# Altium schematic sheet Sunsat Full Schematic.SchDoc
size A4; SheetNumber: 3; SheetTotal: 4
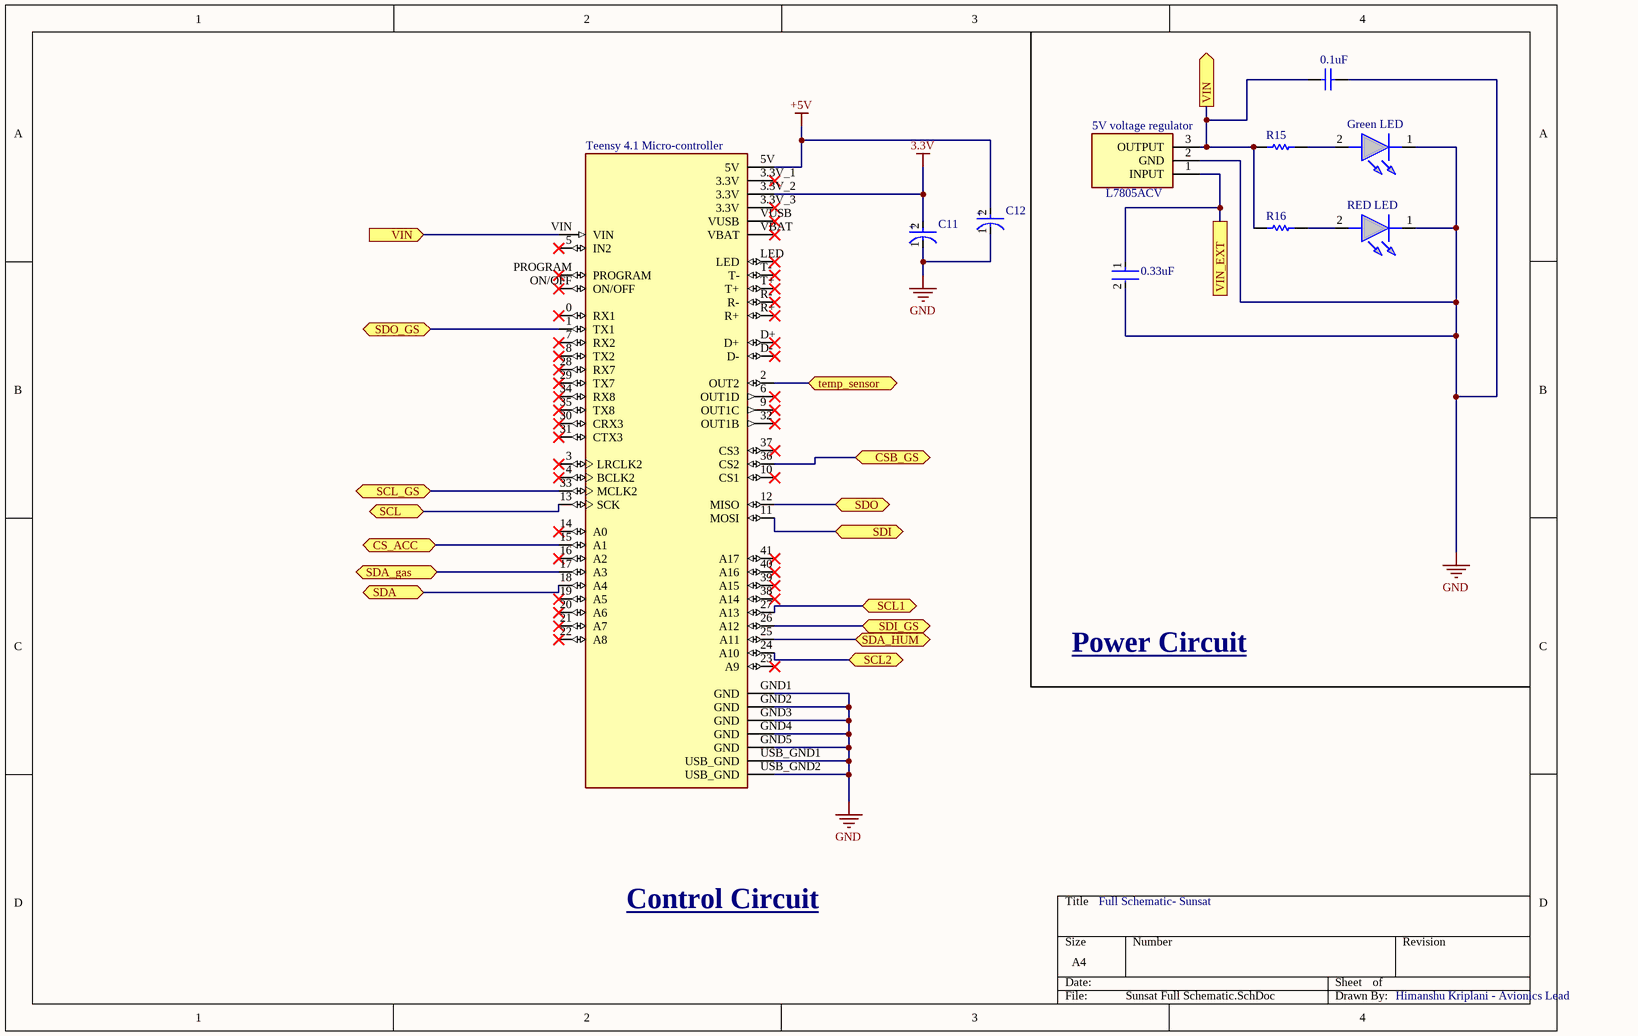
[diagram p0: Sunsat Full Schematic.SchDoc]

## Parts
0.1uF  GRM188R71H104KA93D  [CAPC1608X90X35ML10T15]  (value not drawn)
0.33uF  C2012X8R1E334K125AA  [FP-C2012-125-0_2-IPC_B]  (value not drawn)
5V_voltage_regulator  L7805ACV  [TO255P460X1020X2008-3P]
C11  293D105X0016A2TE3  [FP-293DA-MFG]  (value not drawn)
C12  293D105X0016A2TE3  [FP-293DA-MFG]  (value not drawn)
Green_LED  ASCKCG00-NW5X5020302  [ASCKCG00NW5X5020302]  (value not drawn)
R15  CRCW0603110RFKEA  [RESC1609X50X30NL10T20]  (value not drawn)
R16  CRCW0603110RFKEA  [RESC1609X50X30NL10T20]  (value not drawn)
RED_LED  ASCKCR00-BU5V5020402  [ASCKCR00BU5V5020402]  (value not drawn)
Teensy_4.1_Micro-controller  Teensy 4.1  [MODULE_DEV-16771]  (value not drawn)

## Ports
CS_ACC (bidir, see Sensors schematic[1D]), CSB_GS (bidir, see Gyro Sensor[2C]), SCL1 (bidir, see Sensors schematic[1B]), SCL2 (bidir, see Sensors schematic[2C]), SCL (bidir, see Sensors schematic[2B], Sensors schematic[4A]), SCL_GS (bidir, see Gyro Sensor[2B]), SDA (bidir, see Sensors schematic[2B]), SDA_gas (bidir, see Sensors schematic[3A]), SDA_HUM (bidir, see Sensors schematic[2C]), SDI (bidir, see Sensors schematic[2C]), SDI_GS (bidir, see Gyro Sensor[2B]), SDO (bidir, see Sensors schematic[2C]), SDO_GS (bidir, see Gyro Sensor[2B]), temp_sensor (bidir, see Sensors schematic[1A]), VIN (in, see Sunsat Full Schematic[4A]), VIN (out, see Sunsat Full Schematic[1A]), VIN_EXT (see Sunsat Full Schematic[4B])

## Nets
3.3V: C11.2(A) Teensy_4.1_Micro-controller.3.3V_2(3.3V)
+5V: C12.2(A) Teensy_4.1_Micro-controller.5V
GND: 0.1uF.2 0.33uF.2 5V_voltage_regulator.2(GND) C11.1(C) C12.1(C) Green_LED.1(K) RED_LED.1(K) Teensy_4.1_Micro-controller.GND1(GND) Teensy_4.1_Micro-controller.GND2(GND) Teensy_4.1_Micro-controller.GND3(GND) Teensy_4.1_Micro-controller.GND4(GND) Teensy_4.1_Micro-controller.GND5(GND) Teensy_4.1_Micro-controller.USB_GND1(USB_GND) Teensy_4.1_Micro-controller.USB_GND2(USB_GND)
CS_ACC: Teensy_4.1_Micro-controller.15(A1) ; port CS_ACC
CSB_GS: Teensy_4.1_Micro-controller.36(CS2) ; port CSB_GS
SCL: Teensy_4.1_Micro-controller.13(SCK) ; port SCL
SCL1: Teensy_4.1_Micro-controller.27(A13) ; port SCL1
SCL2: Teensy_4.1_Micro-controller.24(A10) ; port SCL2
SCL_GS: Teensy_4.1_Micro-controller.33(MCLK2) ; port SCL_GS
SDA: Teensy_4.1_Micro-controller.18(A4) ; port SDA
SDA_gas: Teensy_4.1_Micro-controller.17(A3) ; port SDA_gas
SDA_HUM: Teensy_4.1_Micro-controller.25(A11) ; port SDA_HUM
SDI: Teensy_4.1_Micro-controller.11(MOSI) ; port SDI
SDI_GS: Teensy_4.1_Micro-controller.26(A12) ; port SDI_GS
SDO: Teensy_4.1_Micro-controller.12(MISO) ; port SDO
SDO_GS: Teensy_4.1_Micro-controller.1(TX1) ; port SDO_GS
temp_sensor: Teensy_4.1_Micro-controller.2(OUT2) ; port temp_sensor
VIN: 0.1uF.1 5V_voltage_regulator.3(OUTPUT) R15.1 R16.1 Teensy_4.1_Micro-controller.VIN ; port VIN
VIN_EXT: 0.33uF.1 5V_voltage_regulator.1(INPUT) ; port VIN_EXT
NetGreen_LED_2: Green_LED.2(A) R15.2
NetR16_2: R16.2 RED_LED.2(A)

Not connected (* = marked no-connect by the designer): Teensy_4.1_Micro-controller 0(RX1)* 3(LRCLK2)* 3.3V_1(3.3V)* 3.3V_3(3.3V)* 4(BCLK2)* 5(IN2)* 6(OUT1D)* 7(RX2)* 8(TX2)* 9(OUT1C)* 10(CS1)* 14(A0)* 16(A2)* 19(A5)* 20(A6)* 21(A7)* 22(A8)* 23(A9)* 28(RX7)* 29(TX7)* 30(CRX3)* 31(CTX3)* 32(OUT1B)* 34(RX8)* 35(TX8)* 37(CS3)* 38(A14)* 39(A15)* 40(A16)* 41(A17)* D+* D-* LED* ON/OFF* PROGRAM* R+* R-* T+* T-* VBAT* VUSB*

## Notes on the sheet
- Power Circuit
- Control Circuit
- Full Schematic- Sunsat
- Himanshu Kriplani - Avionics Lead
- (in symbol CMP-00030-40940187-1) +

## Library data of the parts
0.1uF = CMP-2100-03643-1: Chip Capacitor, 0.1 uF, +/- 10%, 50 V, -55 to 125 degC, 0603 (1608 Metric), RoHS, Tape and Reel; Manufacturer: Murata; Dielectric Material: Ceramic; Voltage Rating: 50V; Capacitance: 100nF; Dielectric: X7R; Insulation Resistance: 10GR; Case Code (Metric): 1608; Lead Free: LeadFree; Depth: 0.8mm; Number of Pins: 2; Radiation Hardening: No; Case/Package: 0603; Manufacturer URL: http://www.murata.com/; Packaging: TapeandReel; Length: 1.6mm; Contact Plating: Tin; Datasheet URL: http://psearch.en.murata.com/capacitor/product/GRM188R71H104KA93%23.pdf; Tolerance: 10%; Case Code (Imperial): 0603; Min Operating Temperature: -55degC; RoHSCompliant: true; Voltage: 50V; Termination: SMD/SMT; Mount: SurfaceMount; Material: Ceramic; Package Quantity: 1; Height: 0.8mm; Thickness: 0.035inch; REACH SVHC: NoSVHC; Max Operating Temperature: 125degC; Width: 0.8mm; Package Reference: 0603; Voltage Rating (DC): 50V; Datasheet Version: 42675.0; Package Description: 2-Pin Surface Mount Device, Body 1.6 x 0.8 mm
0.33uF = CMP-08246-004363-1: Multilayer Ceramic Capacitors 330nF ±10% 25V X8R SMD 0805; Mount: Surface Mount; Termination: SMD/SMT; Max Operating Temperature: 150°C; Voltage Rating (DC): 25V; Voltage Rating: 25V; Min Operating Temperature: -55°C; Case/Package: 0805; Packaging: Tape and Reel; Width: 0.049inch; Dielectric: X8R; Depth: 1.25mm; Case Code (Imperial): 0805; Capacitance: 330nF; Thickness: 0.057inch; RoHS Compliant: Yes; Features: High Temperature; Resistor Type: Ceramic; Series: C; Height: 1.25mm; Number of Pins: 2; Package Quantity: 1; REACH SVHC: No SVHC; Length: 2mm; Weight: 0.000194oz; Tolerance: 10%; Case Code (Metric): 2012
5V_voltage_regulator = CMP-028-000000-1: Linear voltage regulator,L7805ACV 5V 1A STMicroelectronics L7805ACV, Single Linear Voltage Regulator, 1A 5 V, 2%, 3-Pin TO-220; Geometry.Height: 4.6mm; Manufacturer_Name: STMicroelectronics; Mouser Part Number: 511-L7805ACV; Mouser Price/Stock: https://www.mouser.co.uk/ProductDetail/STMicroelectronics/L7805ACV?qs=xv3lWMc77RdYd2PeLwOwYw%3D%3D; Manufacturer_Part_Number: L7805ACV; Design Item ID: L7805ACV; Datasheet Link: http://www.st.com/web/en/resource/technical/document/datasheet/CD00000444.pdf; Source: L7805ACV.SchLib
C11 C12 = CMP-00030-40940187-1: 293D105X0016A2TE3 Surface Mount Tantalum Capacitor, 1 uF, 16 V, ± 20%, -55 °C, 125 °C, 1206 [3216-18 Metric]; Ripple Current: 90mA; Capacitance: 1µF; Leakage Current: 500nA; Polarity: Polar; Voltage Rating (DC): 16V; Dissipation Factor: 4%; ESR (Equivalent Series Resistance): 9.3Ω; Case Code (Imperial): 1206; Case/Package: 1206; Schedule B: 8532210050, 8532210050; Height: 1.8mm; Mount: PCB, Surface Mount; Height - Seated (Max): 1.8034mm; Min Operating Temperature: -55°C; Max Operating Temperature: 125°C; Dielectric Material: Tantalum; Packaging: Tape and Reel; Radiation Hardening: No; Lead Free: Lead Free; Features: General Purpose; REACH SVHC: Unknown; Width: 1.6002mm; RoHS: Compliant; Tolerance: 20%; Termination: SMD/SMT; Length: 3.2mm; Depth: 1.6mm; Number of Pins: 2; Voltage Rating: 16V; NexarPartId: 40940187; Case Code (Metric): 3216
Green_LED = CMP-004-00031-1: Green 524nm LED Indication - Discrete 3.3V 0603 (1608 Metric); Manufacturer_Name: Avago Technologies; Geometry.Height: 0.75mm; Mouser Price/Stock: https://www.mouser.co.uk/ProductDetail/Broadcom-Avago/ASCKCG00-NW5X5020302?qs=OcgtsXO%252B3gsRJ%252BJUmBwdbA%3D%3D; Manufacturer_Part_Number: ASCKCG00-NW5X5020302; Source: ASCKCG00-NW5X5020302.SchLib; Design Item ID: ASCKCG00-NW5X5020302; Datasheet Link: https://docs.broadcom.com/doc/ASCKCx00-xxxxx0x0x02-DS; Mouser Part Number: 630-ASCKCG00NW5X5020
R15 R16 = CMP-2000-03854-1: Manufacturer: Vishay Dale; Part Number: CRCW0603110RFKEA
RED_LED = CMP-004-00032-1: Red 622nm LED Indication - Discrete 2.1V 0603 (1608 Metric); Manufacturer_Name: Avago Technologies; Geometry.Height: 0.75mm; Mouser Part Number: 630-ASCKCR00BU5V5020; Mouser Price/Stock: https://www.mouser.co.uk/ProductDetail/Broadcom-Avago/ASCKCR00-BU5V5020402?qs=OcgtsXO%252B3gu355%2FiA8jcWA%3D%3D; Source: ASCKCR00-BU5V5020402.SchLib; Datasheet Link: https://docs.broadcom.com/doc/ASCKCx00-xxxxx0x0x02-DS; Manufacturer_Part_Number: ASCKCR00-BU5V5020402; Design Item ID: ASCKCR00-BU5V5020402
Teensy_4.1_Micro-controller = CMP-003-000000-1: RT1062 Teensy 4.1 series ARMÂ® CortexÂ®-M7 MPU Embedded Evaluation Board; MF: SparkFun Electronics; MP: DEV-16771; Package: None; Component Type: Standard; Pin Count: 65; Purchase-URL: https://pricing.snapeda.com/search/part/DEV-16771/?ref=eda; SnapEDA_Link: https://www.snapeda.com/parts/DEV-16771/SparkFun+Electronics/view-part/?ref=snap; Availability: In Stock; Source: DEV-16771.SchLib; Design Item ID: DEV-16771; Check_prices: https://www.snapeda.com/parts/DEV-16771/SparkFun+Electronics/view-part/?ref=eda; Value: *; Price: None